# Altium schematic sheet NX3225GD-8MHZ-STD-CRA-3_2022-02-28.schdoc
size 39 x 26 mm
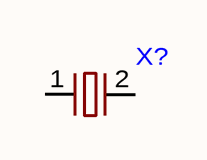
[diagram p0: NX3225GD-8MHZ-STD-CRA-3_2022-02-28.schdoc]

## Parts
X?  (no value)  [OSC-SMD_2P-L3.2-W2.5]

## Nets

Not connected (* = marked no-connect by the designer): X? 1 2(GND)

## Library data of the parts
X? = NX3225GD-8MHZ-STD-CRA-3